# EAGLE design emg (EAGLE 9.2.2)

## Sheet 1 of 4
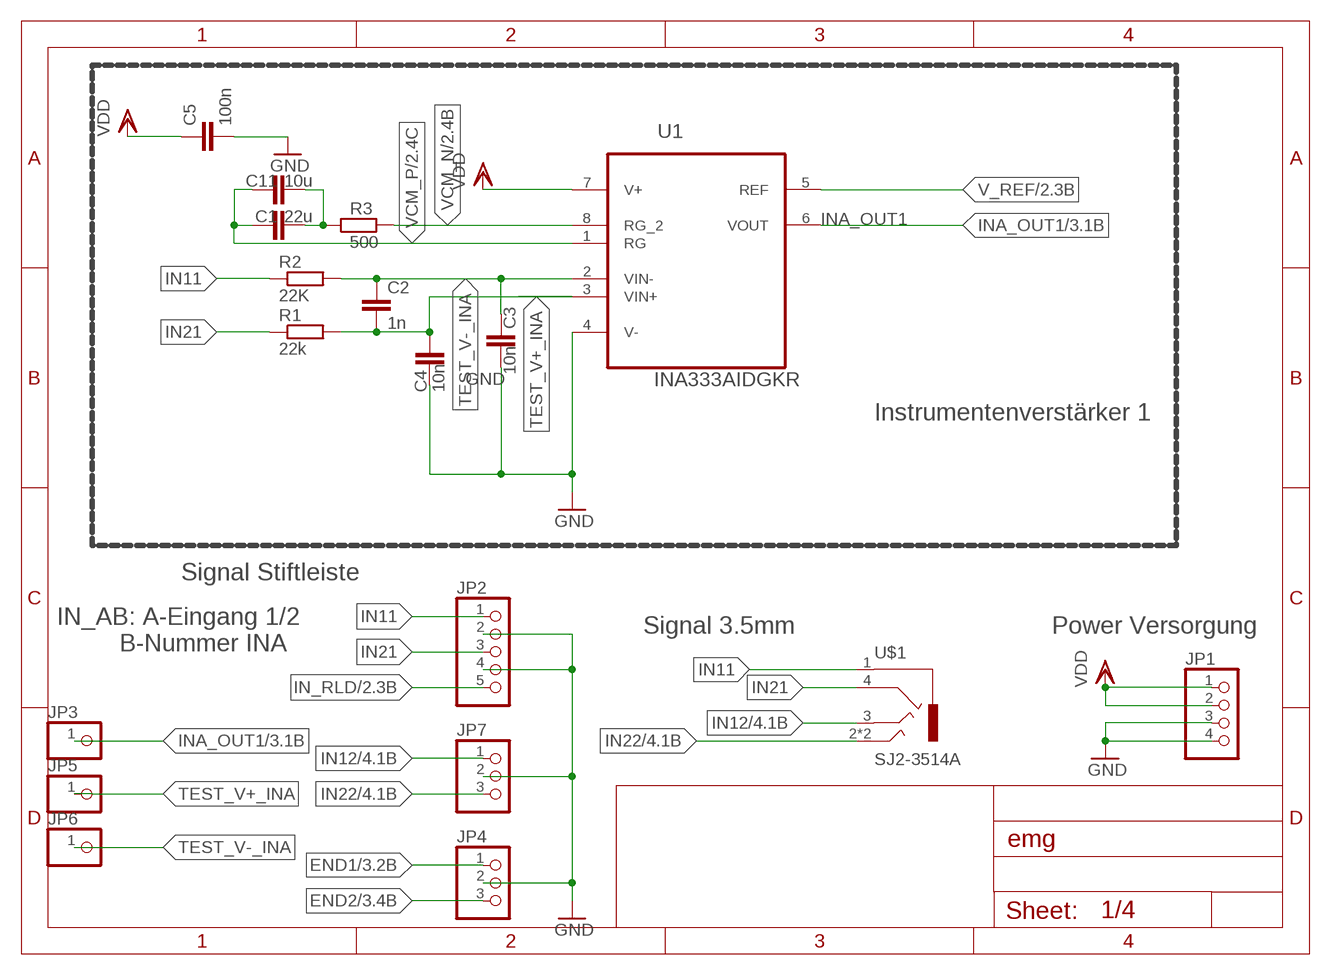
[diagram p0: schematic, sheet 1]

### Parts
C1  22u  C-EUC0805  [C0805]
C2  1n  C-EUC0805  [C0805]
C3  10n  C-EUC0805  [C0805]
C4  10n  C-EUC0805  [C0805]
C5  100n  C-EUC0805  [C0805]
C11  10u  C-EUC0805  [C0805]
JP1  PINHD-1X4  [1X04]
JP2  PINHD-1X5  [1X05]
JP3  PINHD-1X1  [1X01]
JP4  PINHD-1X3  [1X03]
JP5  PINHD-1X1  [1X01]
JP6  PINHD-1X1  [1X01]
JP7  PINHD-1X3  [1X03]
R1  22k  R-EU_R0805  [R0805]
R2  22K  R-EU_R0805  [R0805]
R3  500  R-EU_R0805  [R0805]
U1  INA333AIDGKR  [SOP65P490X110-8N]
U$1  SJ2-3514A  [USR_SJ2-4514A]

### Nets
END1: JP4.1 ; also sheet 3
END2: JP4.3 ; also sheet 3
GND: C3.2 C4.2 C5.2 JP1.3 JP1.4 JP2.2 JP2.4 JP4.2 JP7.2 U1.4(V-) ; also sheet 2,3,4
IN11: JP2.1 R2.1 U$1.1
IN12: JP7.1 U$1.3 ; also sheet 4
IN21: JP2.3 R1.1 U$1.4
IN22: JP7.3 U$1.2 U$1.2_2 ; also sheet 4
IN_RLD: JP2.5 ; also sheet 2
INA_OUT1: JP3.1 U1.6(VOUT) ; also sheet 3
N$4: C1.2 C11.2 R3.1
TEST_V+_INA: C2.2 C4.1 JP5.1 R1.2 U1.3(VIN+)
TEST_V-_INA: C2.1 C3.1 JP6.1 R2.2 U1.2(VIN-)
V_REF: U1.5(REF) ; also sheet 2,3,4
VCM_N: R3.2 U1.8(RG_2) ; also sheet 2
VCM_P: C1.1 C11.1 U1.1(RG) ; also sheet 2
VDD: C5.1 JP1.1 JP1.2 U1.7(V+) ; also sheet 2,3,4

### Notes on the sheet
- Instrumentenverstärker 1
- Signal Stiftleiste
- Signal 3.5mm | Power Versorgung
- IN_AB: A-Eingang 1/2 
           B-Nummer INA

## Sheet 2 of 4
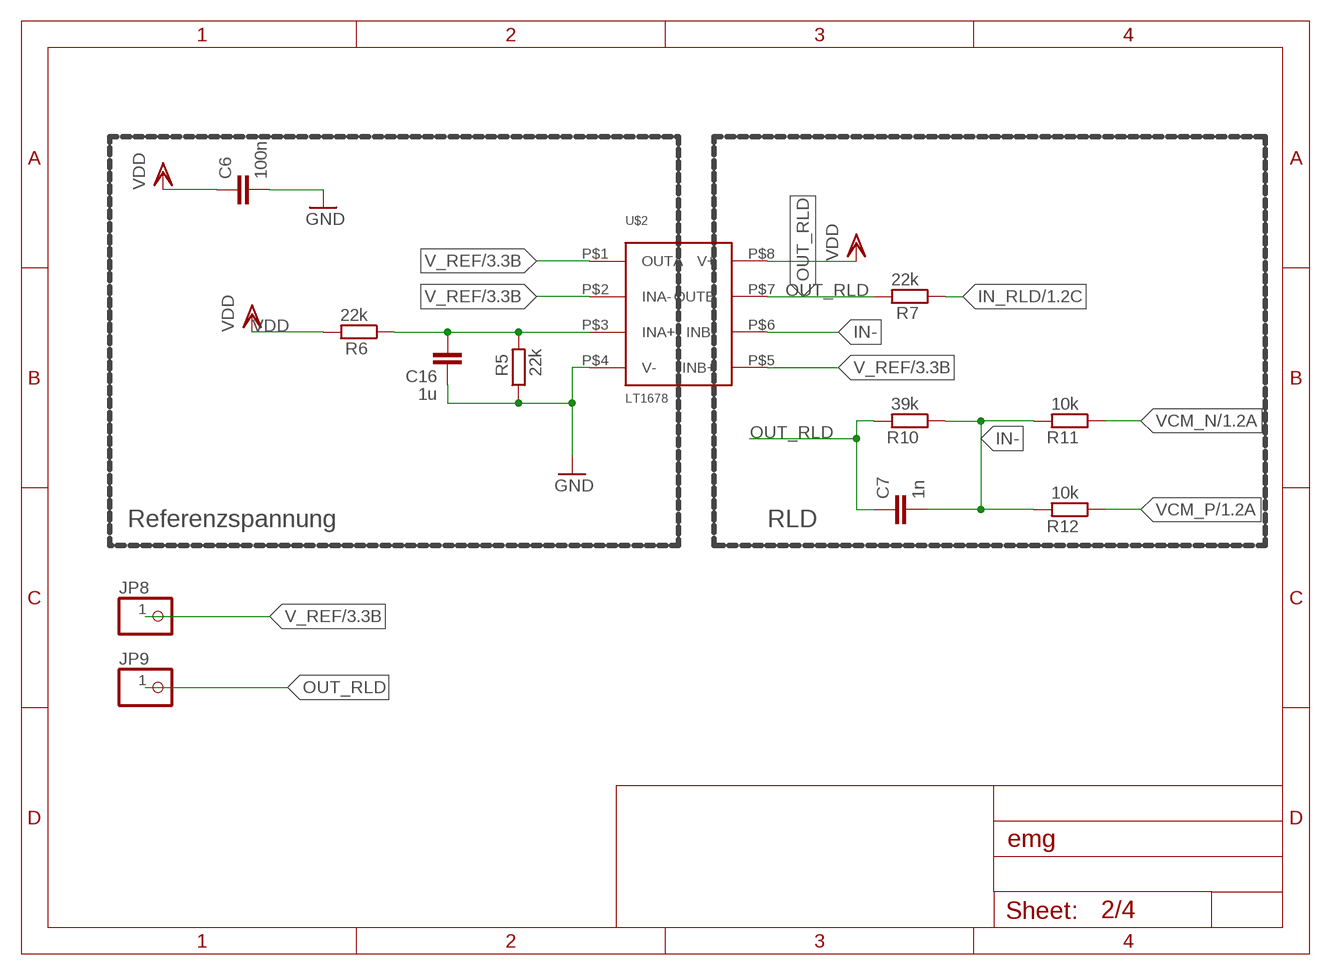
[diagram p1: schematic, sheet 2]

### Parts
C6  100n  C-EUC0805  [C0805]
C7  1n  C-EUC0805  [C0805]
C16  1u  C-EUC0805  [C0805]
JP8  PINHD-1X1  [1X01]
JP9  PINHD-1X1  [1X01]
R5  22k  R-EU_R0805  [R0805]
R6  22k  R-EU_R0805  [R0805]
R7  22k  R-EU_R0805  [R0805]
R10  39k  R-EU_R0805  [R0805]
R11  10k  R-EU_R0805  [R0805]
R12  10k  R-EU_R0805  [R0805]
U$2  LT1678  [S8]

### Nets
GND: C6.2 C16.1 R5.1 U$2.P$4(V-) ; also sheet 1,3,4
IN-: C7.2 R10.1 R11.2 R12.2 U$2.P$6(INB-)
IN_RLD: R7.1 ; also sheet 1
N$11: C16.2 R5.2 R6.1 U$2.P$3(INA+)
OUT_RLD: C7.1 JP9.1 R7.2 R10.2 U$2.P$7(OUTB)
V_REF: JP8.1 U$2.P$1(OUTA) U$2.P$2(INA-) U$2.P$5(INB+) ; also sheet 1,3,4
VCM_N: R11.1 ; also sheet 1
VCM_P: R12.1 ; also sheet 1
VDD: C6.1 R6.2 U$2.P$8(V+) ; also sheet 1,3,4

### Notes on the sheet
- Referenzspannung | RLD

## Sheet 3 of 4
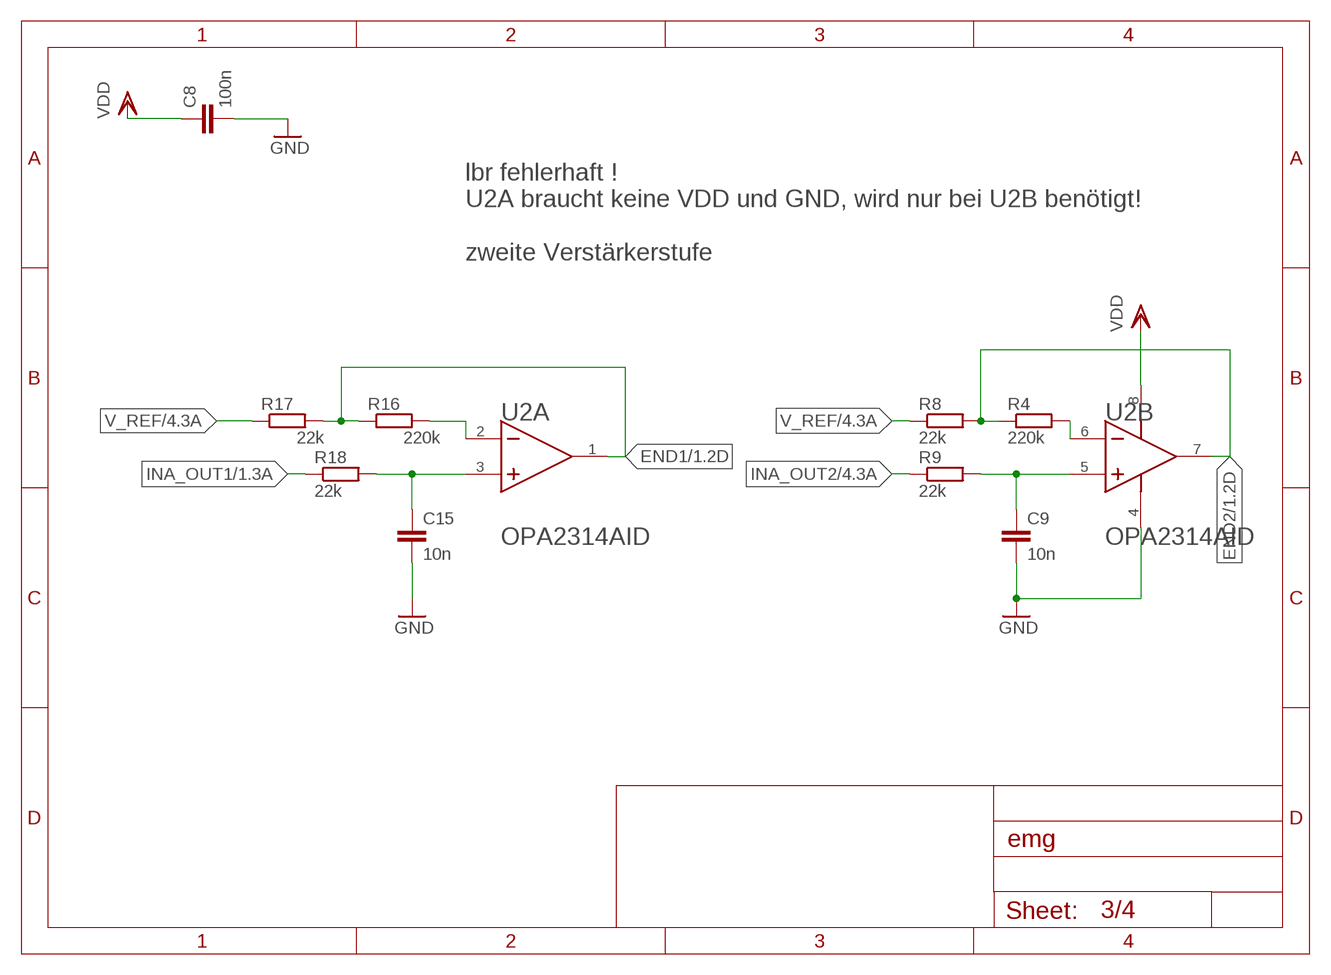
[diagram p2: schematic, sheet 3]

### Parts
C8  100n  C-EUC0805  [C0805]
C9  10n  C-EUC0805  [C0805]
C15  10n  C-EUC0805  [C0805]
R4  220k  R-EU_R0805  [R0805]
R8  22k  R-EU_R0805  [R0805]
R9  22k  R-EU_R0805  [R0805]
R16  220k  R-EU_R0805  [R0805]
R17  22k  R-EU_R0805  [R0805]
R18  22k  R-EU_R0805  [R0805]
U2  TEXAS_INSTRUMENTS_OPA2314AIDTEXAS_INSTRUMENTS_OPA2314AID_0_0  [TEXAS_INSTRUMENTS_OPA2314AID_0]

### Nets
END1: R16.1 R17.2 U2.1(A:OUT_A) ; also sheet 1
END2: R4.1 R8.2 U2.7(B:OUT_B) ; also sheet 1
GND: C8.2 C9.2 C15.2 U2.4(B:V-) ; also sheet 1,2,4
INA_OUT1: R18.1 ; also sheet 1
INA_OUT2: R9.1 ; also sheet 4
N$8: C9.1 R9.2 U2.5(B:IN_B+)
N$10: R4.2 U2.6(B:IN_B-)
N$16: R16.2 U2.2(A:IN_A-)
N$17: C15.1 R18.2 U2.3(A:IN_A+)
V_REF: R8.1 R17.1 ; also sheet 1,2,4
VDD: C8.1 U2.8(B:V+) ; also sheet 1,2,4

### Notes on the sheet
- lbr fehlerhaft !
  U2A braucht keine VDD und GND, wird nur bei U2B benötigt!
  
  zweite Verstärkerstufe

## Sheet 4 of 4
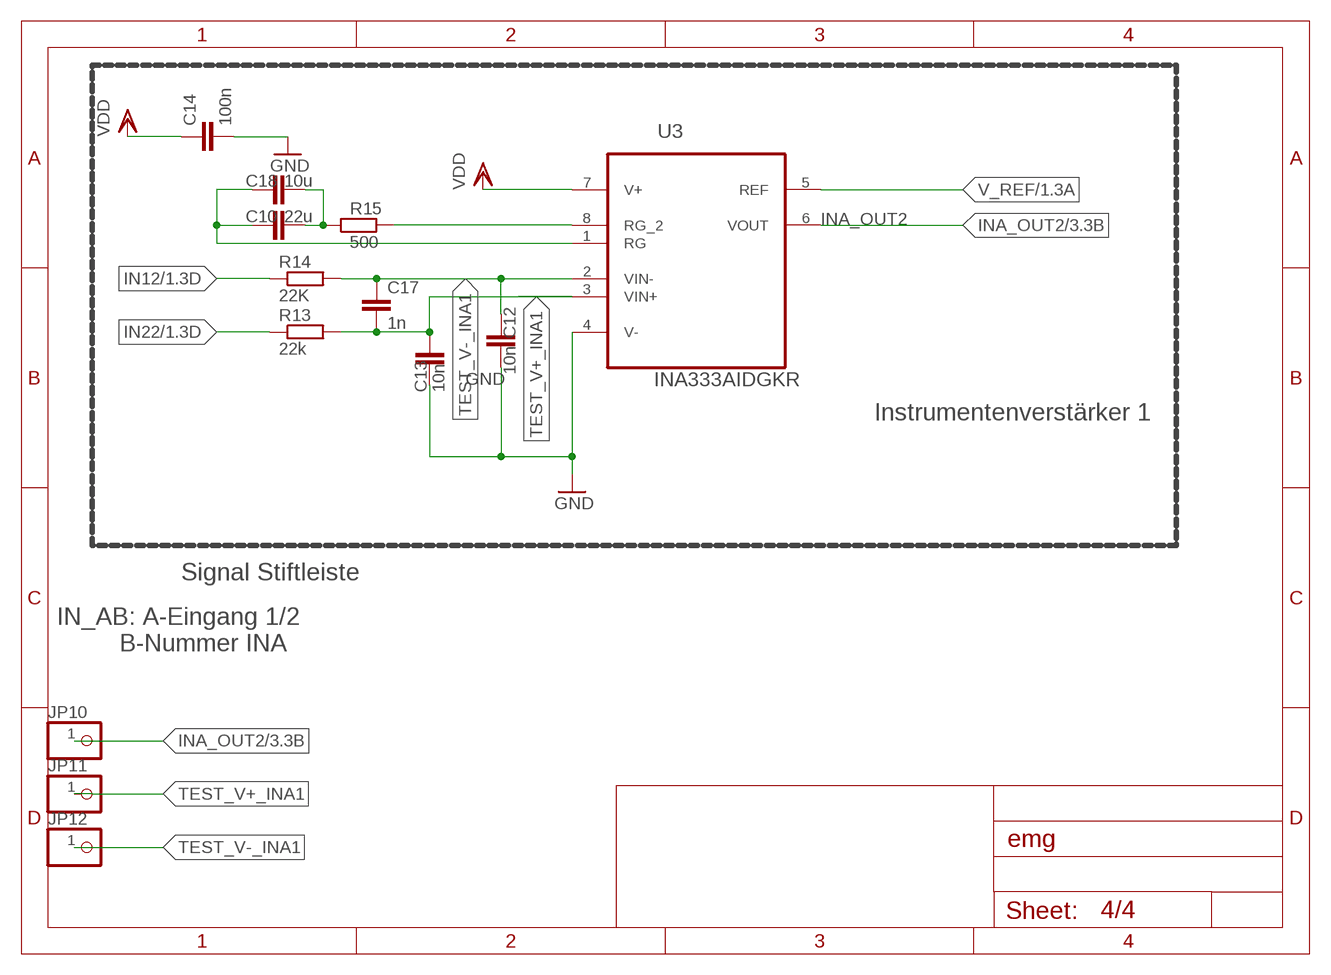
[diagram p3: schematic, sheet 4]

### Parts
C10  22u  C-EUC0805  [C0805]
C12  10n  C-EUC0805  [C0805]
C13  10n  C-EUC0805  [C0805]
C14  100n  C-EUC0805  [C0805]
C17  1n  C-EUC0805  [C0805]
C18  10u  C-EUC0805  [C0805]
JP10  PINHD-1X1  [1X01]
JP11  PINHD-1X1  [1X01]
JP12  PINHD-1X1  [1X01]
R13  22k  R-EU_R0805  [R0805]
R14  22K  R-EU_R0805  [R0805]
R15  500  R-EU_R0805  [R0805]
U3  INA333AIDGKR  [SOP65P490X110-8N]

### Nets
GND: C12.2 C13.2 C14.2 U3.4(V-) ; also sheet 1,2,3
IN12: R14.1 ; also sheet 1
IN22: R13.1 ; also sheet 1
INA_OUT2: JP10.1 U3.6(VOUT) ; also sheet 3
N$1: C10.2 C18.2 R15.1
N$2: R15.2 U3.8(RG_2)
N$3: C10.1 C18.1 U3.1(RG)
TEST_V+_INA1: C13.1 C17.2 JP11.1 R13.2 U3.3(VIN+)
TEST_V-_INA1: C12.1 C17.1 JP12.1 R14.2 U3.2(VIN-)
V_REF: U3.5(REF) ; also sheet 1,2,3
VDD: C14.1 U3.7(V+) ; also sheet 1,2,3

### Notes on the sheet
- Instrumentenverstärker 1
- Signal Stiftleiste
- IN_AB: A-Eingang 1/2 
           B-Nummer INA

## Library data of the parts
C1-C18 = rcl:C-EU: CAPACITOR, European symbol; SPICEPREFIX: C
JP1 = pinhead:PINHD-1X4: PIN HEADER
JP2 = pinhead:PINHD-1X5: PIN HEADER
JP3 JP5 JP6 JP8-JP12 = pinhead:PINHD-1X1: PIN HEADER
JP4 JP7 = pinhead:PINHD-1X3: PIN HEADER
R1-R18 = rcl:R-EU_: RESISTOR, European symbol; SPICEPREFIX: R
U1 U3 = INA333AIDGKR:INA333AIDGKR: 0.05ìV/°C max, SINGLE-SUPPLY CMOS OPERATIONAL AMPLIFIERS Zer.-Drift Series; MPN: INA333AIDGKR; OC_FARNELL: 2295977; OC_NEWARK: 01P0907; PACKAGE: MSOP-8; SUPPLIER: Texas Instruments
U2 = Texas Instruments - OPA2314AID:TEXAS_INSTRUMENTS_OPA2314AID: TI-OPA-8_2; CIIVA_IDS: 3236142; CMRR_MIND_B: 75; CODE__JEDEC: MS-012; COMPONENT_LINK_1_DESCRIPTION: Manufacturer URL; COMPONENT_LINK_1_URL: http://www.ti.com/; COMPONENT_LINK_3_DESCRIPTION: Package Specification; COMPONENT_LINK_3_URL: http://www.ti.com/litv/pdf/msoi002j; DATASHEET: http://www.ti.com/lit/ds/symlink/opa2314.pdf; DATASHEET_VERSION: SBOS563E; ECO__PLAN: Green (RoHS & no Sb/Br); FOOTPRINT_VARIANT_NAME_0: Level C; FOOTPRINT_VARIANT_NAME_1: Level B; FOOTPRINT_VARIANT_NAME_2: Level A; GBW_TYP_MHZ: 3; IIB_MAXP_A: 10; IMPORTED: yes; IMPORTED_FROM: vault; IMPORT_TS: 1521849348; IQ_PER_CHANNELMAXMA: 0.19; MF: Texas Instruments; MOUNTING_TECHNOLOGY: Surface Mount; MPN: OPA2314AID; NUMBER_OF_CHANNELS: 2; OFFSET_DRIFTTYPUVC: 1; PACKAGE: D0008A; PACKAGE_DESCRIPTION: 8-Pin Plastic Small Outline, Body 4.9 x 3.9 mm, Pitch 1.27 mm; PACKAGE_VERSION: 4040047-3/M, 06/2011; PACKING: TUBE; PREFIX: U; RATING: Catalog; RELEASE_DATE: 1464326787; SLEW_RATETYPVUS: 1.5; TOTAL_SUPPLY_VOLTAGEMAX5V_IS_5__5V_IS_10: 5.5; TOTAL_SUPPLY_VOLTAGEMIN5V_IS_5__5V_IS_10: 1.8; VAULT_GUID: FC3CCBEA-EF8A-4D47-8376-D421FB011C9F; VAULT_REVISION: 64FE72A6-CE39-49AD-A8CF-FF128F609D7E; VIO_25CMAXMV: 2.5
U$1 = USR_SJ2-4514a:SJ2-3514A
U$2 = LT1678:LT1678: LT1678 dual OPV RRIO S8 8-Lead SO Package Single Supply Farnell OC: 1330689

## Board
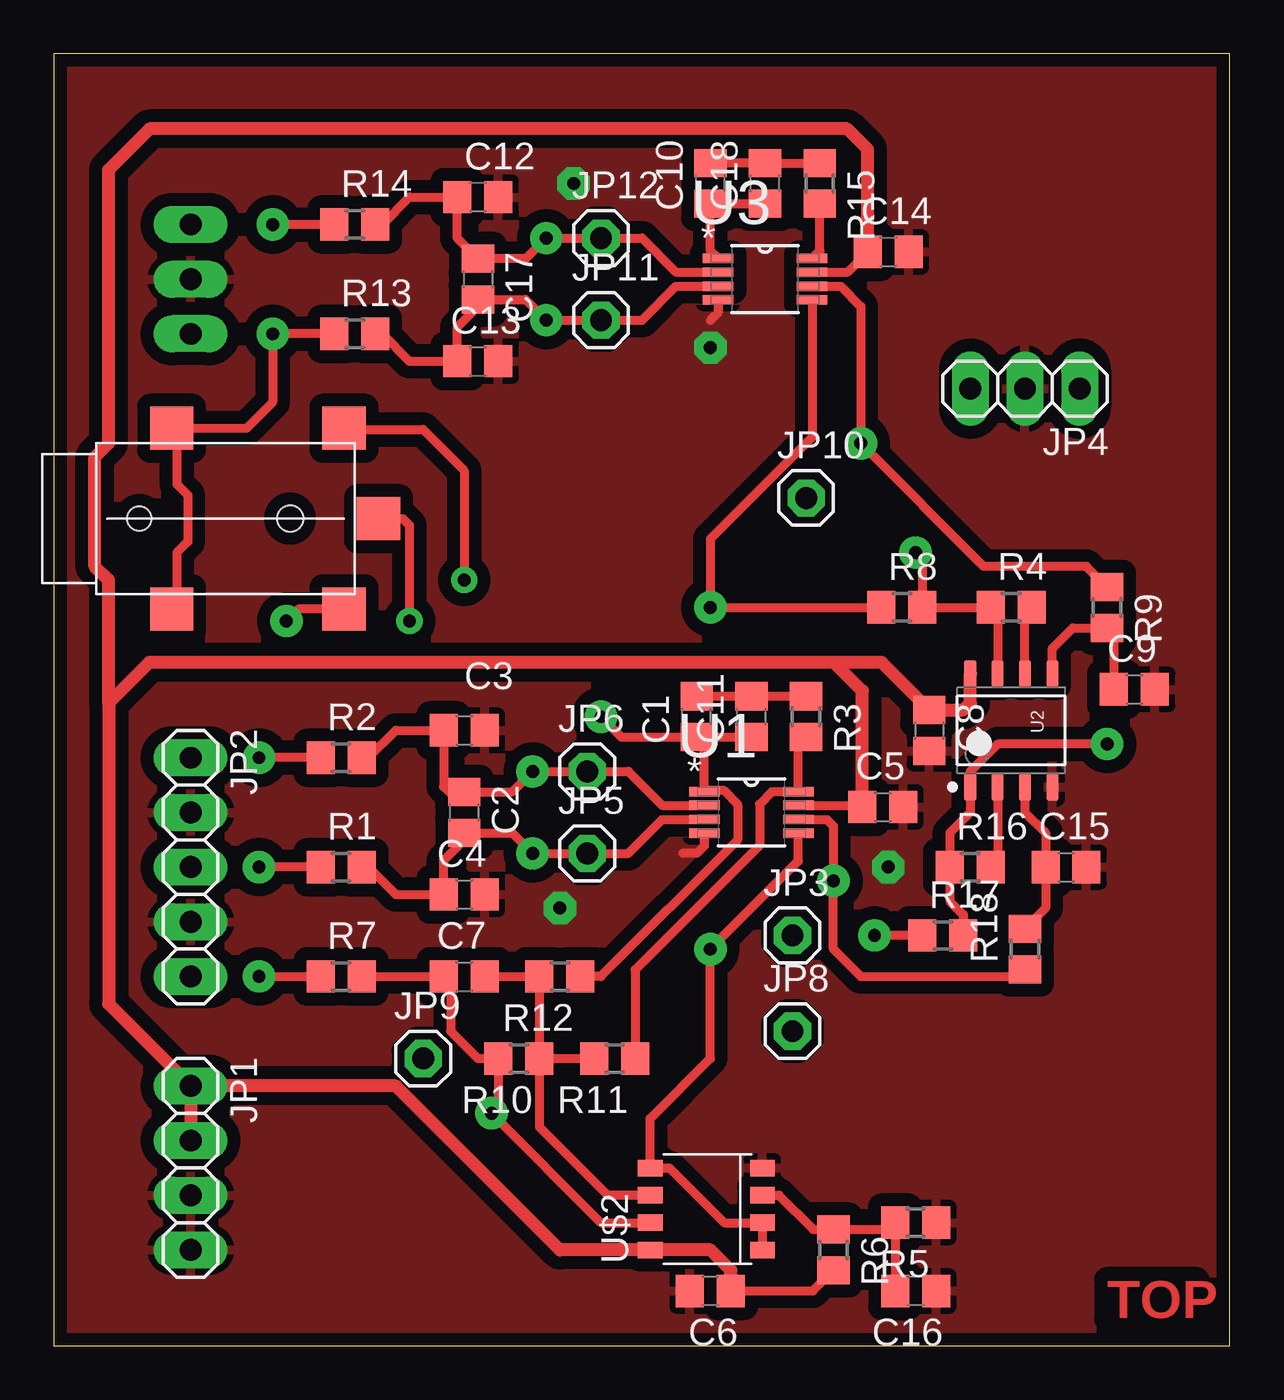
[diagram p4: board, top side]
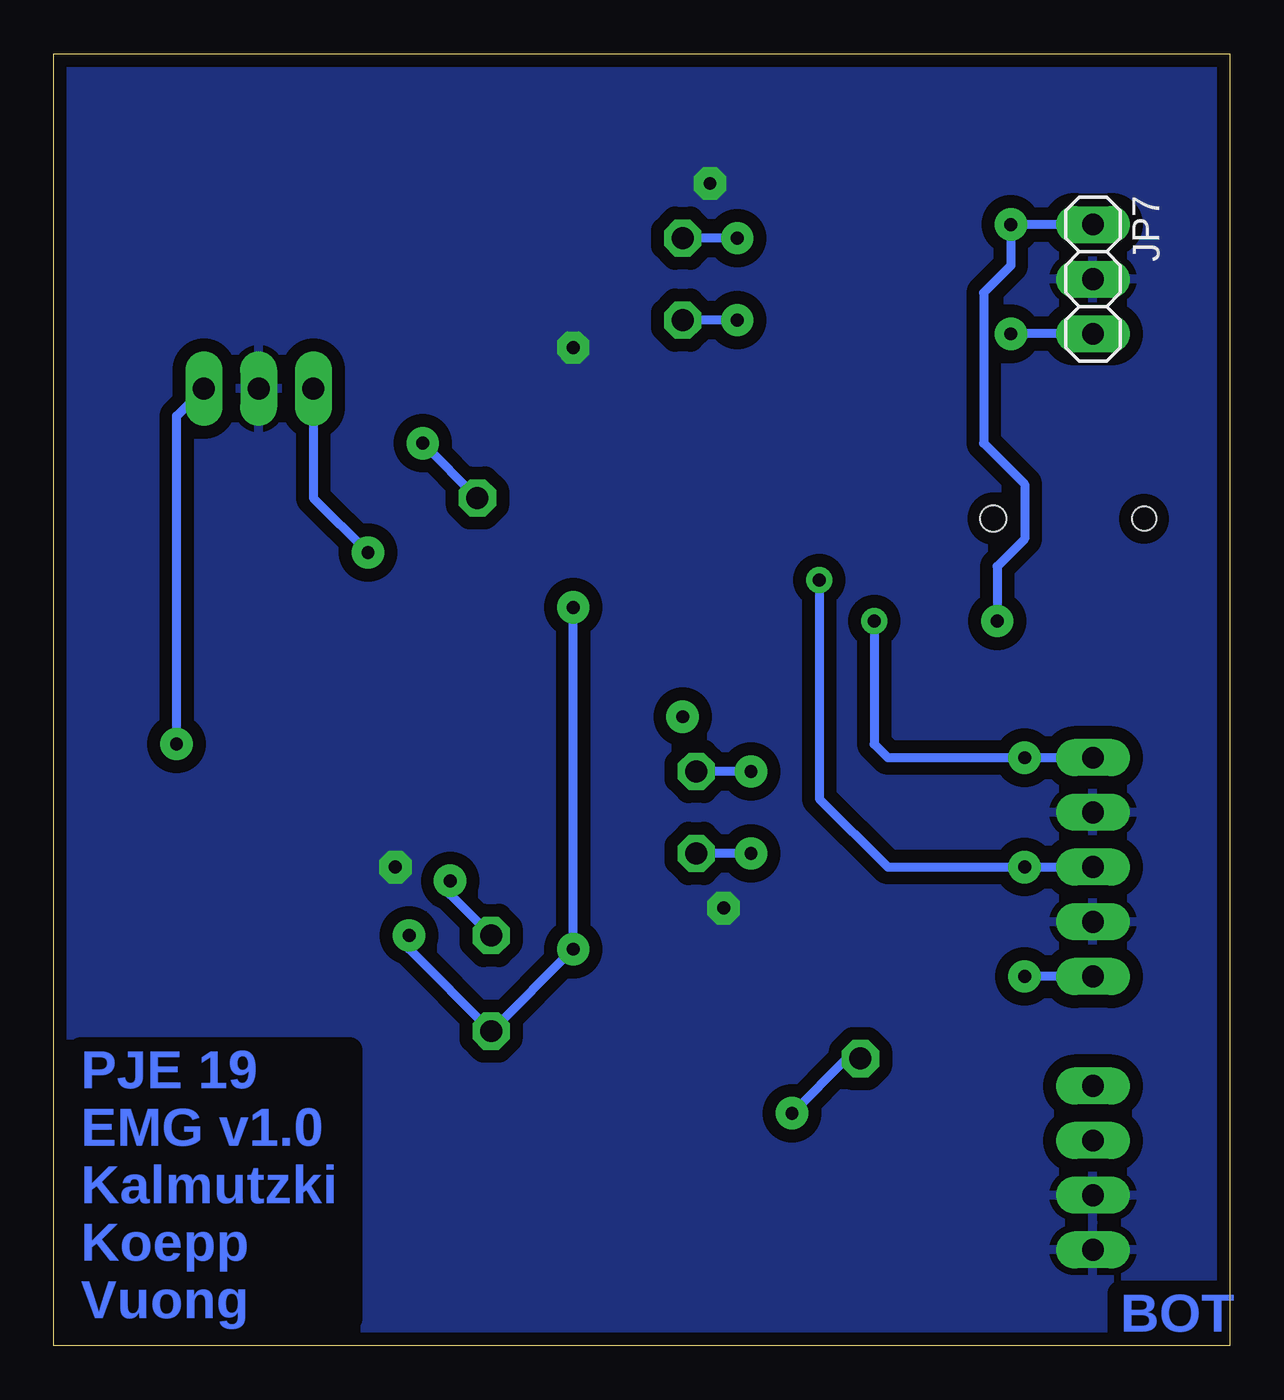
[diagram p5: board, bottom side, seen from below]

Size 54.59 x 59.99 mm. Coordinates in mm from the lower left corner, seen from the top.
Outline: 0,0 54.59,0 54.59,59.99 0,59.99 0,0
Copper layers (1*16): Top 0.035mm / dielectric 1.5mm / Bottom 0.035mm
Design rules "EMSP_SMD_DRC_2019": minimum track width 13mil, minimum drill 0.6mm, track to track 11mil, track to pad 0.25mm, pad to pad 0.25mm, via to via 11mil, smd to smd 8mil, copper to edge 20mil, drill to drill 16mil, minimum pad ring 12mil, minimum via ring 12mil, stop-mask expansion 4mil, vias tented up to drill 0mil, thermal gap 12mil

### Footprints (pad centres in the part's own frame; a part is rotated, then mirrored left to right if it is on the bottom)
C0805 = smd 1.3 x 1.5: 1 -0.95,0; 2 0.95,0
1X04 = drill 1.016 long: 1 -3.81,0; 2 -1.27,0; 3 1.27,0; 4 3.81,0
1X05 = drill 1.016 long: 1 -5.08,0; 2 -2.54,0; 3 0,0; 4 2.54,0; 5 5.08,0
1X01 = drill 1.016 octagon: 1 0,0
1X03 = drill 1.016 long: 1 -2.54,0; 2 0,0; 3 2.54,0
R0805 = smd 1.3 x 1.5: 1 -0.95,0; 2 0.95,0
SOP65P490X110-8N = smd 1.422 x 0.432: 1 -2.184,0.965; 2 -2.184,0.33; 3 -2.184,-0.33; 4 -2.184,-0.965; 5 2.184,-0.965; 6 2.184,-0.33; 7 2.184,0.33; 8 2.184,0.965
TEXAS_INSTRUMENTS_OPA2314AID_0 = smd 1.25 x 0.55: 1 -2.625,1.905; 2 -2.625,0.635; 3 -2.625,-0.635; 4 -2.625,-1.905; 5 2.625,-1.905; 6 2.625,-0.635; 7 2.625,0.635; 8 2.625,1.905
USR_SJ2-4514A = smd 2 x 2: 1 -1.1,3.5; 2 8.5,-0.7; 2_2 8.5,7.7; 3 0.5,7.7; 4 0.5,-0.7 | hole 1.1: 10,3.5 | hole 1.2: 3,3.5
S8 = smd 0.762 x 1.143: P$1 -1.905,-2.413; P$2 -0.635,-2.413; P$3 0.635,-2.413; P$4 1.905,-2.413; P$5 1.905,2.794; P$6 0.635,2.794; P$7 -0.635,2.794; P$8 -1.905,2.794

### Placement (x,y rotation side)
C1  29.84,29.21 90 top
C2  19.05,24.77 270 top
C3  19.05,28.58 0 top
C4  19.05,20.95 0 top
C5  38.48,25.02 0 top
C6  30.48,2.54 180 top
C7  19.05,17.14 0 top
C8  40.64,28.58 270 top
C9  50.16,30.48 0 top
C10  30.48,53.98 90 top
C11  32.38,29.21 90 top
C12  19.68,53.34 0 top
C13  19.68,45.72 0 top
C14  38.73,50.8 0 top
C15  46.99,22.23 0 top
C16  40.01,2.54 180 top
C17  19.68,49.53 270 top
C18  33.02,53.98 90 top
JP1  6.35,8.25 270 top
JP2  6.35,22.23 270 top
JP3  34.29,19.05 0 top
JP4  45.09,44.45 180 top
JP5  24.77,22.86 0 top
JP6  24.77,26.67 0 top
JP7  6.35,49.53 270 bottom
JP8  34.29,14.61 0 top
JP9  17.14,13.34 0 top
JP10  34.92,39.37 0 top
JP11  25.4,47.62 0 top
JP12  25.4,51.44 0 top
R1  13.34,22.23 0 top
R2  13.34,27.3 0 top
R3  34.92,29.21 270 top
R4  44.45,34.29 0 top
R5  40.01,5.71 180 top
R6  36.2,4.45 270 top
R7  13.34,17.14 0 top
R8  39.37,34.29 0 top
R9  48.89,34.29 270 top
R10  21.59,13.34 180 top
R11  26.04,13.34 180 top
R12  23.49,17.14 180 top
R13  13.97,46.99 0 top
R14  13.97,52.07 0 top
R15  35.56,53.98 270 top
R16  42.55,22.23 0 top
R17  41.27,19.05 0 top
R18  45.09,18.41 90 top
U1  32.38,24.77 0 top
U2  44.45,28.58 90 top
U3  33.02,49.53 0 top
U$1  13.97,41.91 180 top
U$2  30.48,6.35 90 top

### Tracks (layer width: path | path; a pad name or v marks a point on that pad's centre or on a via)
END1  (via drill 0.6 pad 1.5)
  Top 0.406: v48.89,27.94 43.81,27.94 42.55,26.67 U2.1 42.55,24.77 41.59,23.81 R16.1 41.59,20.63 42.23,20 R17.2
  Bottom 0.406: v48.89,27.94 48.89,43.18 JP4.1
END2  (via drill 0.6 pad 1.5)
  Top 0.406: v40.01,36.83 40.32,36.52 R8.2 R4.1 43.81,33.98 U2.7
  Bottom 0.406: JP4.3 42.55,39.37 v40.01,36.83
GND  (via drill 0.6 pad 1.5)
  Top 0.406: U3.4 30.84,47.98 30.48,47.62 | U1.4 30.2,23.22 29.84,22.86 29.21,22.86
  other vias: 38.73,22.23 23.49,20.32 30.48,46.35 24.13,53.98
  pour Bottom (isolate 0.6): -0.01,59.69 54.61,59.69 54.61,-0.63 0.64,-0.63
  pour Top (isolate 0.6): 0,59.69 54.61,59.69 54.61,-0.63 0,-0.63
IN11  (via drill 0.6, 0.6 pad 1.5)
  Top 0.406: R2.1 v9.53,27.3 | U$1.1 16.2,38.41 16.51,38.1 v16.51,33.66
  Bottom 0.406: JP2.1 v9.53,27.3 15.88,27.3 16.51,27.94 v16.51,33.66
IN12  (via drill 0.6 pad 1.5)
  Top 0.406: R14.1 v10.16,52.07 | U$1.3 11.35,34.21 v10.8,33.66
  Bottom 0.406: JP7.1 v10.16,52.07 10.16,50.16 11.43,48.9 11.43,41.91 9.53,40.01 9.53,37.47 10.8,36.2 v10.8,33.66
IN21  (via drill 0.6, 0.6 pad 1.5)
  Top 0.406: R1.1 v9.53,22.23 | U$1.4 13.54,42.55 17.14,42.55 19.05,40.64 v19.05,35.56
  Bottom 0.406: JP2.3 v9.53,22.23 15.88,22.23 19.05,25.4 v19.05,35.56
IN22  (via drill 0.6 pad 1.5)
  Top 0.406: R13.1 v10.16,46.99 10.16,43.81 8.96,42.61 U$1.2 5.71,42.37 5.71,40.01 6.22,39.5 6.22,37.34 5.71,36.83 5.71,34.45 U$1.2_2
  Bottom 0.406: JP7.3 v10.16,46.99
IN-
  Top 0.406: R10.1 R12.2 C7.2 | R10.1 R11.2 | R10.1 22.54,10.16 25.71,6.98 U$2.P$6
IN_RLD  (via drill 0.6 pad 1.5)
  Top 0.406: v9.53,17.14 R7.1
  Bottom 0.406: JP2.5 v9.53,17.14
INA_OUT1  (via drill 0.6 pad 1.5)
  Top 0.406: U1.6 35.89,24.44 36.2,24.13 v36.2,21.59 36.2,18.41 37.46,17.14 44.77,17.14 R18.1
  Bottom 0.406: JP3.1 36.2,20.95 v36.2,21.59
INA_OUT2  (via drill 0.6 pad 1.5)
  Top 0.406: R9.1 47.94,36.2 43.18,36.2 v37.46,41.91 37.46,48.26 36.52,49.2 U3.6
  Bottom 0.406: v37.46,41.91 JP10.1
N$1
  Top 0.406: R15.1 C18.2 C10.2
N$2
  Top 0.406: U3.8 35.56,50.85 R15.2
N$3
  Top 0.406: U3.1 30.48,50.85 C10.1 C18.1
N$4
  Top 0.406: C1.2 C11.2 R3.1
N$8
  Top 0.406: U2.5 46.35,32.38 47.31,33.34 R9.2 49.21,33.02 C9.1
N$10
  Top 0.406: U2.6 45.09,33.98 R4.2
N$11
  Top 0.406: C16.2 R5.2 38.73,5.39 R6.1 35.24,5.39 33.66,6.98 U$2.P$3
N$16
  Top 0.406: U2.2 43.81,22.55 R16.2
N$17
  Top 0.406: U2.3 45.09,24.77 46.04,23.81 C15.1 46.04,20.32 R18.2
OUT_RLD  (via drill 0.6 pad 1.5)
  Top 0.406: R7.2 C7.1 18.41,16.83 18.41,14.61 19.68,13.34 R10.2 20.64,11.12 v20.32,10.8 25.4,5.71 U$2.P$7
  Bottom 0.406: JP9.1 17.78,13.34 v20.32,10.8
TEST_V+_INA  (via drill 0.6 pad 1.5)
  Top 0.406: R1.2 14.61,22.23 15.88,20.95 C4.1 18.1,22.55 19.05,23.49 C2.2 21.27,23.81 v22.22,22.86 26.67,22.86 28.24,24.44 U1.3
  Bottom 0.406: v22.22,22.86 JP5.1
TEST_V+_INA1  (via drill 0.6 pad 1.5)
  Top 0.406: R13.2 15.24,46.99 16.51,45.72 C13.1 18.73,47.31 19.68,48.26 C17.2 21.9,48.58 v22.86,47.62 27.3,47.62 28.88,49.2 U3.3
  Bottom 0.406: v22.86,47.62 JP11.1
TEST_V-_INA  (via drill 0.6 pad 1.5)
  Top 0.406: R2.2 14.61,27.3 15.88,28.58 C3.1 18.1,25.97 18.41,25.65 18.99,25.65 C2.1 21.27,25.72 v22.22,26.67 26.67,26.67 28.24,25.09 U1.2
  Bottom 0.406: v22.22,26.67 JP6.1
TEST_V-_INA1  (via drill 0.6 pad 1.5)
  Top 0.406: R14.2 15.24,52.07 16.51,53.34 C12.1 18.73,51.43 C17.1 21.9,50.48 v22.86,51.44 27.3,51.44 28.88,49.86 U3.2
  Bottom 0.406: v22.86,51.44 JP12.1
V_REF  (via drill 0.6 pad 1.5)
  Top 0.406: U$2.P$1 U$2.P$2 31.11,5.71 28.57,8.25 U$2.P$5 27.69,10.54 30.48,13.34 v30.48,18.41 34.57,22.5 U1.5 | R8.1 v30.48,34.29 30.48,37.47 35.2,42.19 U3.5 | R17.1 v38.1,19.05
  Bottom 0.406: v30.48,34.29 v30.48,18.41 JP8.1 38.1,18.41 v38.1,19.05
VCM_N
  Top 0.406: R3.2 34.57,27.9 U1.8 33.35,25.73 32.77,25.15 32.77,23.24 26.98,17.46 R11.1
VCM_P  (via drill 0.6 pad 1.5)
  Top 0.406: 30.48,28.26 C1.1 26.35,28.26 v25.4,29.21 | 30.48,28.26 C11.1 | U1.1 30.2,25.78 | 30.2,25.78 30.2,27.98 30.48,28.26 | 30.2,25.78 31.11,25.78 31.75,25.15 31.75,23.49 25.4,17.14 R12.1
VDD
  Top 0.406: U3.7 36.84,49.86 C14.1 | R6.2 35.24,2.54 C6.1 | U1.7 37.45,25.09 C5.1
  Top 0.61: C14.1 37.78,55.56 36.83,56.51 4.45,56.51 2.54,54.61 2.54,41.91 1.91,41.27 1.91,36.2 2.54,35.56 2.54,29.84 | JP1.1 2.54,15.88 2.54,29.84 | JP1.1 JP1.2 | 2.54,29.84 4.45,31.75 36.2,31.75 | JP1.1 15.88,12.07 23.49,4.45 U$2.P$8 30.48,4.45 31.43,3.5 C6.1 | 36.2,31.75 38.41,31.75 C8.1 42.23,29.52 42.55,29.84 U2.8 | C5.1 37.53,30.41 36.2,31.75

### Text on the board
Top: TOP
Bottom: PJE 19 / EMG v1.0 / Kalmutzki / Koepp / Vuong | BOT